# EAGLE design solderstation_v1_6 (EAGLE 6.5.0)
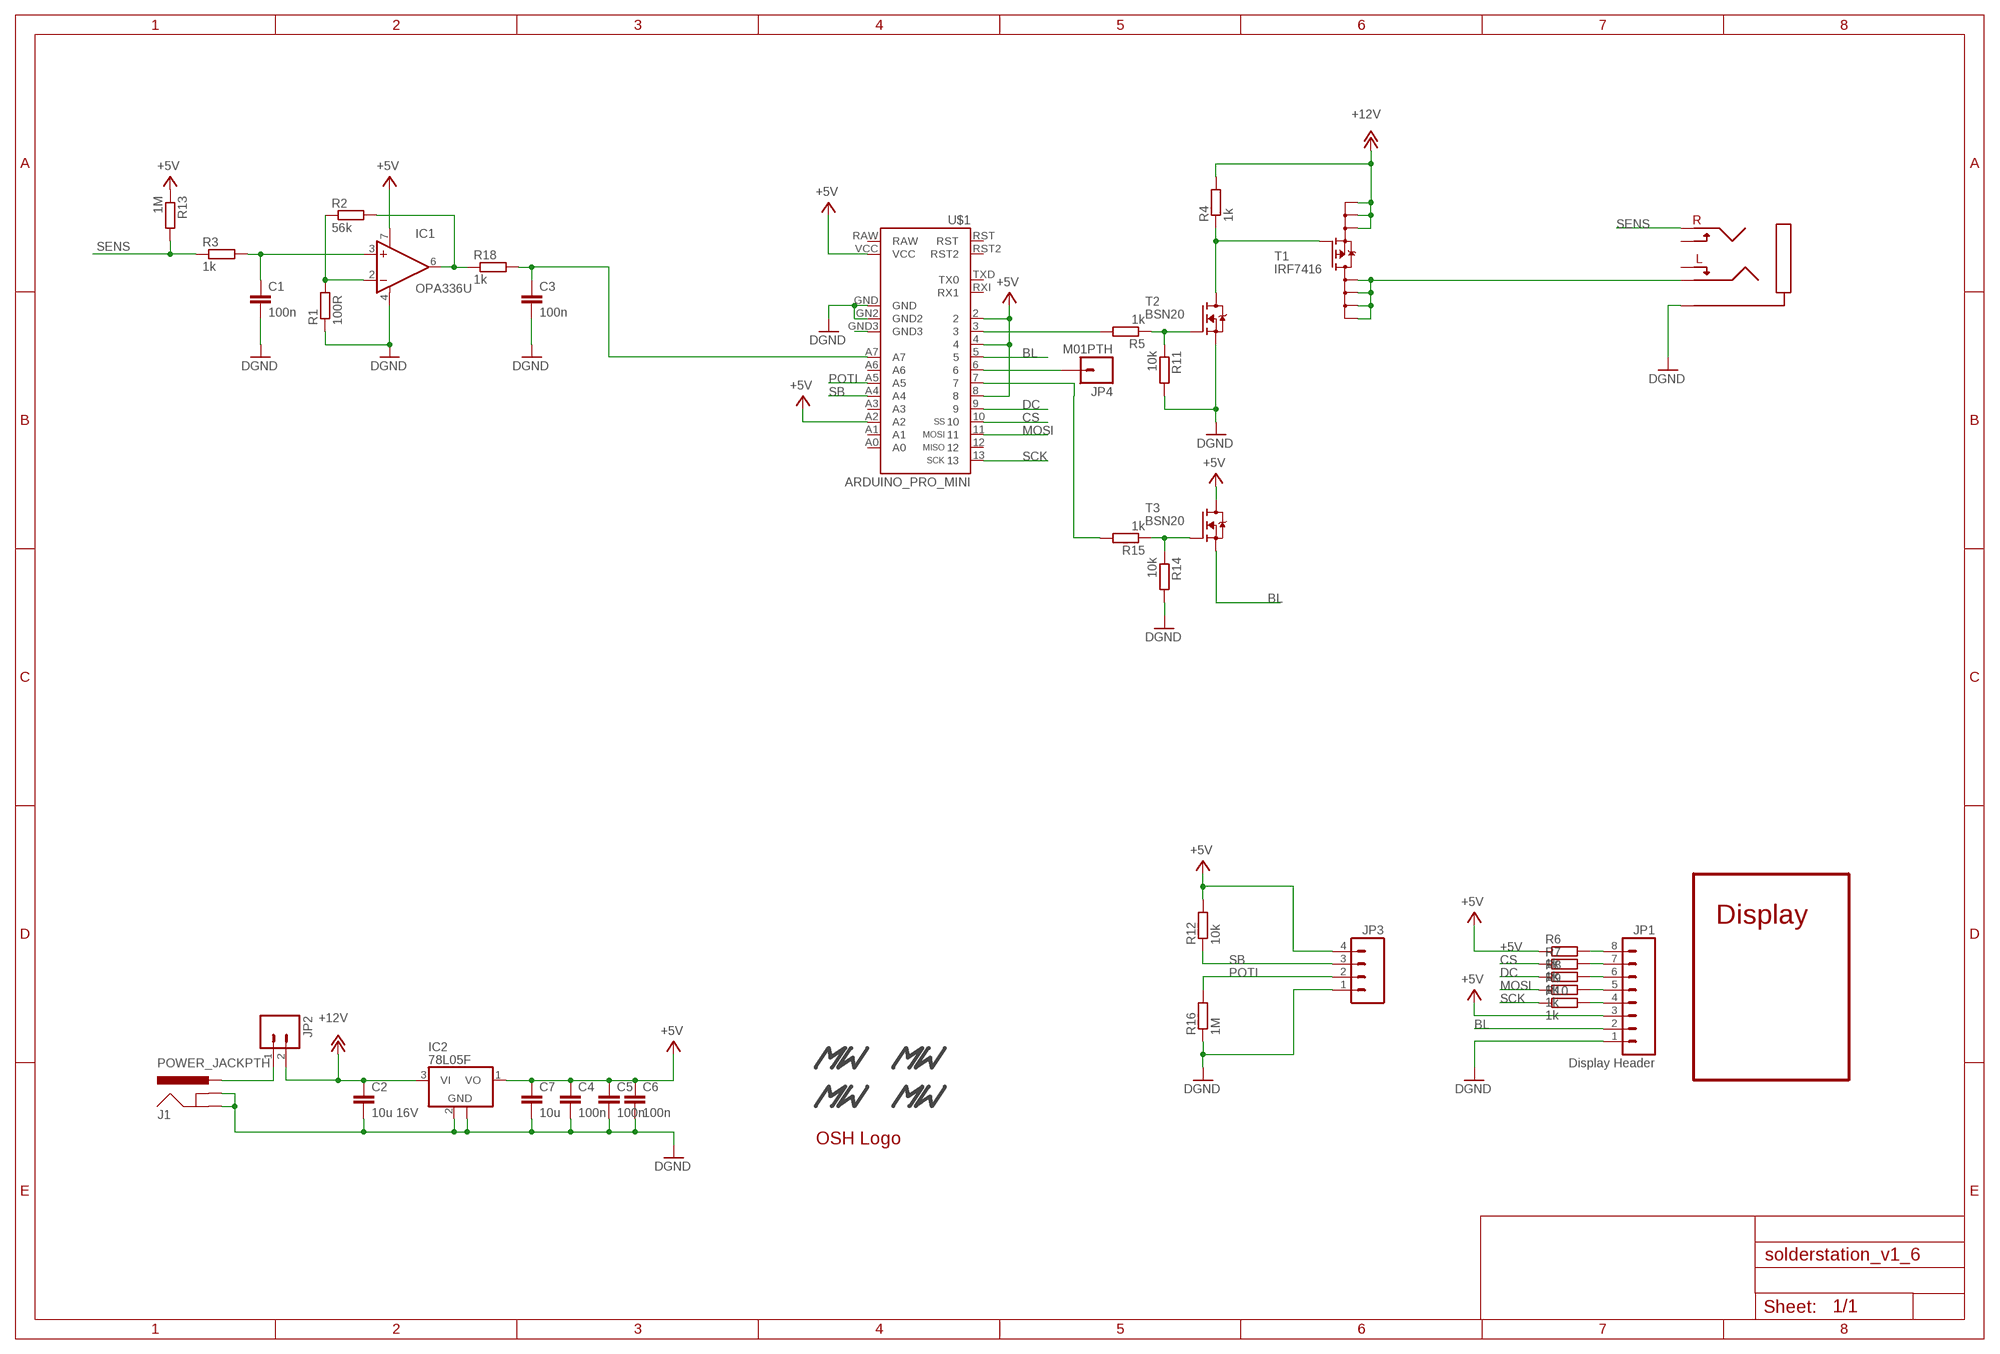
[diagram p0: schematic, sheet 1]

## Parts
C1  100n  C-EUC0603  [C0603]
C2  10u 16V  C-EUC1206  [C1206]
C3  100n  C-EUC0603  [C0603]
C4  100n  C-EUC0603  [C0603]
C5  100n  C-EUC0603  [C0603]
C6  100n  C-EUC0603  [C0603]
C7  10u  C-EUC1206  [C1206]
IC1  OPA336U  [SO08]
IC2  78L05F  [SOT89]
J1  POWER_JACKPTH  [POWER_JACK_PTH]
JP1  Display Header  M08LOCK  [1X08_LOCK]
JP2  M02LOCK_LONGPADS  [1X02_LOCK_LONGPADS]
JP3  M04LOCK  [1X04_LOCK]
JP4  M01PTH  [1X01]
R1  100R  R-EU_R0603  [R0603]
R2  56k  R-EU_R0603  [R0603]
R3  1k  R-EU_R0603  [R0603]
R4  1k  R-EU_R0603  [R0603]
R5  1k  R-EU_R0603  [R0603]
R6  1k  R-EU_R0603  [R0603]
R7  1k  R-EU_R0603  [R0603]
R8  1k  R-EU_R0603  [R0603]
R9  1k  R-EU_R0603  [R0603]
R10  1k  R-EU_R0603  [R0603]
R11  10k  R-EU_R0603  [R0603]
R12  10k  R-EU_R0603  [R0603]
R13  1M  R-EU_R0603  [R0603]
R14  10k  R-EU_R0603  [R0603]
R15  1k  R-EU_R0603  [R0603]
R16  1M  R-EU_R0603  [R0603]
R18  1k  R-EU_R0603  [R0603]
T1  IRF7416  [SO8]
T2  BSN20  [SOT23]
T3  BSN20  [SOT23]
U$1  ARDUINO_PRO_MINI  [ARDUINO_PRO_MINI]
U$2  AUDIO_JACK_3,5MMCONRAD  [AUDIO_JACK_3,5MM_CONRAD]
U$3  MW_LOGO  [MW_11X5MM]
U$4  MW_LOGO_SOLDER  [MW_11X5MM_SOLDER]
U$5  MW_LOGO  [MW_11X5MM]
U$8  OSH_LOGOS  [OSH_LOGO_S]
U$9  MW_LOGO_SOLDER  [MW_11X5MM_SOLDER]

## Nets
+5V: C4.1 C5.1 C6.1 C7.1 IC1.7(V+) IC2.1(VO) JP1.3 JP3.4 R6.1 R12.2 R13.1 T3.3(D) U$1.2 U$1.4 U$1.8 U$1.A2 U$1.VCC
+12V: C2.1 IC2.3(VI) JP2.2 R4.2 T1.1(S0) T1.2(S1) T1.3(S2)
BL: JP1.2 T3.2(S) U$1.5
CS: R7.1 U$1.10
DC: R8.1 U$1.9
DGND: C1.2 C2.2 C3.2 C4.2 C5.2 C6.2 C7.2 IC1.4(V-) IC2.2(GND) IC2.2@1(GND) J1.GND J1.GNDBREAK JP1.1 JP3.1 R1.1 R11.2 R14.2 R16.1 T2.2(S) U$1.GN2(GND2) U$1.GND U$2.P_GND
HEATER: T1.5(D0) T1.6(D1) T1.7(D2) T1.8(D3) U$2.P_LEFT
MOSI: R9.1 U$1.11
N$1: IC1.2(-IN) R1.2 R2.1
N$2: IC1.6(OUT) R2.2 R18.1
N$3: R5.1 R11.1 T2.1(G)
N$4: C1.1 IC1.3(+IN) R3.2
N$5: R4.1 T1.4(G) T2.3(D)
N$6: JP1.4 R10.2
N$7: R5.2 U$1.3
N$8: JP1.5 R9.2
N$9: JP1.6 R8.2
N$10: JP1.7 R7.2
N$11: JP1.8 R6.2
N$12: U$1.GND3
N$13: J1.PWR JP2.1
N$14: R14.1 R15.1 T3.1(G)
N$15: R15.2 U$1.7
N$16: JP4.1 U$1.6
N$31: C3.1 R18.2 U$1.A7
POTI: JP3.2 R16.2 U$1.A5
SB: JP3.3 R12.1 U$1.A4
SCK: R10.1 U$1.13
SENS: R3.1 R13.2 U$2.P_RIGHT
Unconnected: U$1.12 U$1.A0 U$1.A1 U$1.A3 U$1.A6 U$1.RAW U$1.RST U$1.RST2 U$1.RXI(RX1) U$1.TXD(TX0) U$2.P_G_L U$2.P_G_R

## Notes on the sheet
- Display

## Library data of the parts
C1-C7 = rcl:C-EU: CAPACITOR, European symbol
IC1 = burr-brown:OPA336: CMOS Operational Amplifiers Single-Supply, MicroPower, MicroAmplifier(TM) Series; MF: TEXAS INSTRUMENT CONNECTORS; MPN: OPA336UA; OC_FARNELL: 1459587; OC_NEWARK: 35C1888
IC2 = linear:78L*: POSITOIV-VOLTAGE REGULATORS Output up to 100 mA Source: http://focus.ti.com/lit/ds/symlink/ua78l05.pdf
J1 = SparkFun:POWER_JACK: Power Jack This is the standard 5.5mm barrel jack for power. The PTH is the most common, proven, reliable, footprint. All others are experimental. The Slot footprint only works if the mill layer is transmitted to the PCB fab house so be warned. Spark Fun Electronics SKU : PRT-00119. Mating wall wart : TOL-00298 (and others)
JP1 = SparkFun:M08: Header 8 Standard 8-pin 0.1" header. Use with straight break away headers (SKU : PRT-00116), right angle break away headers (PRT-00553), swiss pins (PRT-00743), machine pins (PRT-00117), and female headers (PRT-00115).
JP2 = SparkFun:M02: Header 2 Standard 2-pin 0.1" header. Use with straight break away headers (SKU : PRT-00116), right angle break away headers (PRT-00553), swiss pins (PRT-00743), machine pins (PRT-00117), and female headers (PRT-00115). Molex polarized connector foot print use with SKU : PRT-08233 with associated crimp pins and housings.
JP3 = SparkFun:M04: Header 4 Standard 4-pin 0.1" header. Use with straight break away headers (SKU : PRT-00116), right angle break away headers (PRT-00553), swiss pins (PRT-00743), machine pins (PRT-00117), and female headers (PRT-00115). Molex polarized connector foot print use with SKU : PRT-08231 with associated crimp pins and housings. 1MM SMD Version SKU: PRT-10208
JP4 = SparkFun:M01: Header 1 Standard 1-pin 0.1" header. Use with straight break away headers (SKU : PRT-00116), right angle break away headers (PRT-00553), swiss pins (PRT-00743), machine pins (PRT-00117), and female headers (PRT-00115).
R1-R16 R18 = rcl:R-EU_: RESISTOR, European symbol
T1 = IRF74xx:IRF7416
T2 T3 = bsn20:BSN20
U$1 = SparkFun:ARDUINO_PRO_MINI
U$2 = Matthias:AUDIO_JACK_3,5MM
U$3 U$5 = MWlogo:MW_LOGO
U$4 U$9 = MWlogo:MW_LOGO_SOLDER
U$8 = Logos:OSH_LOGO

## Board
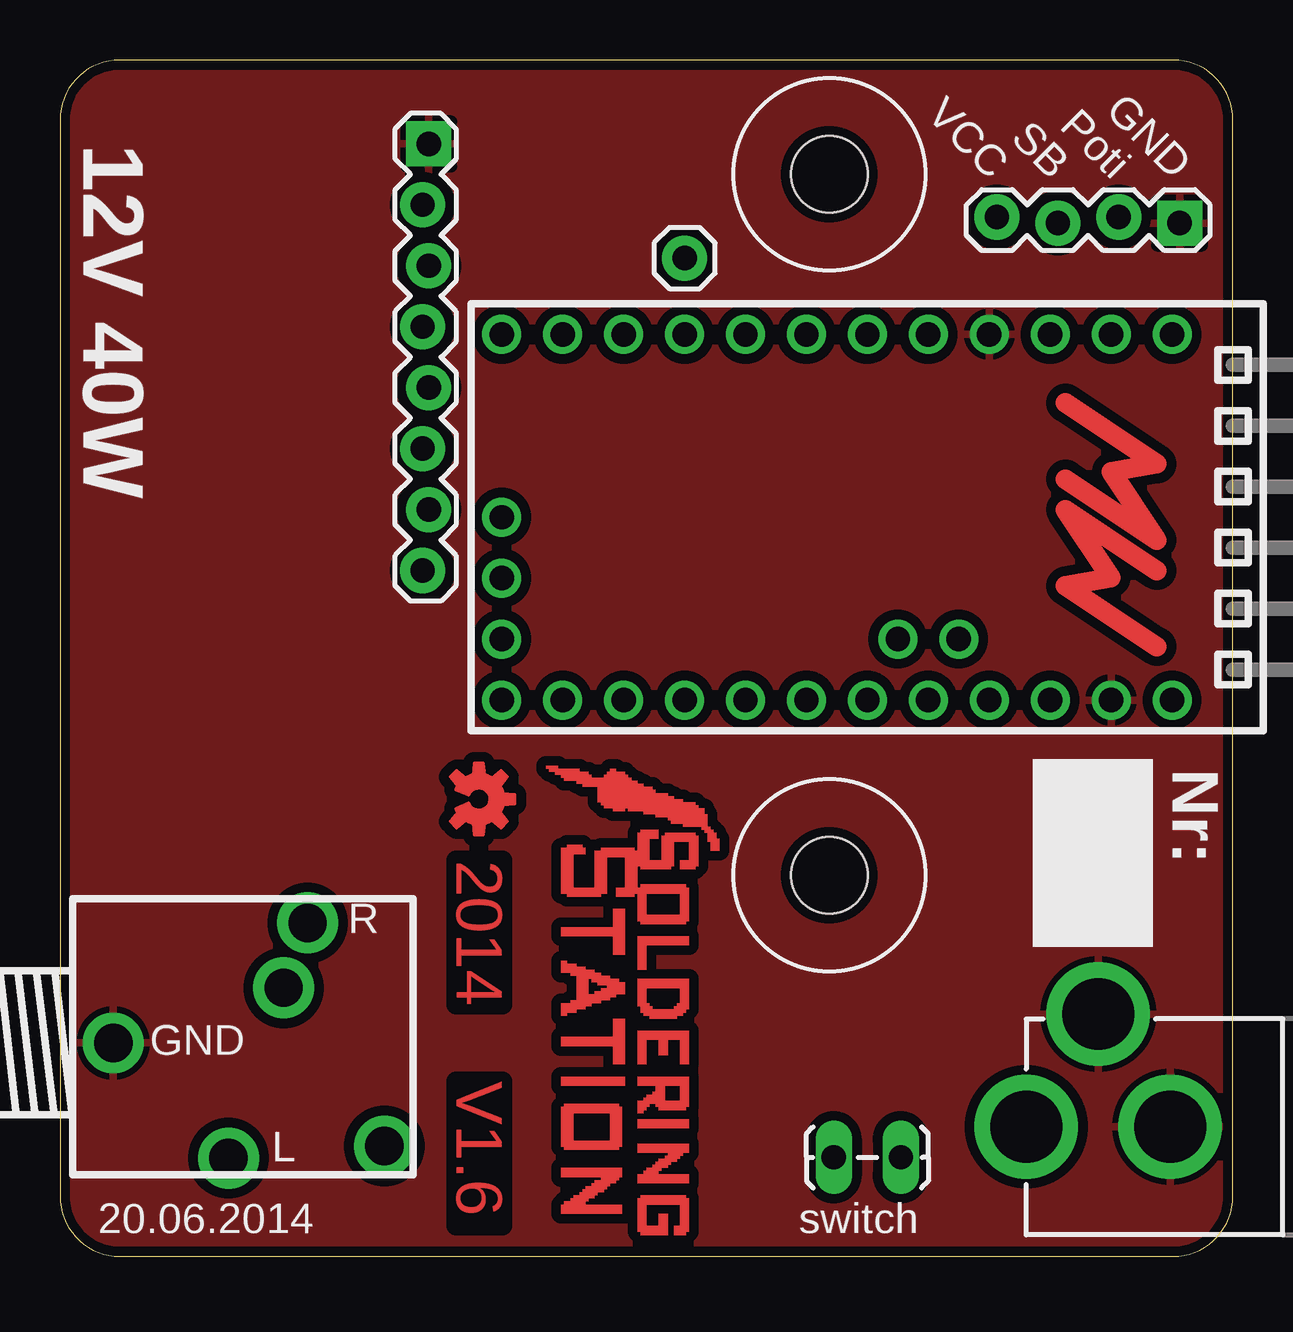
[diagram p1: board, top side]
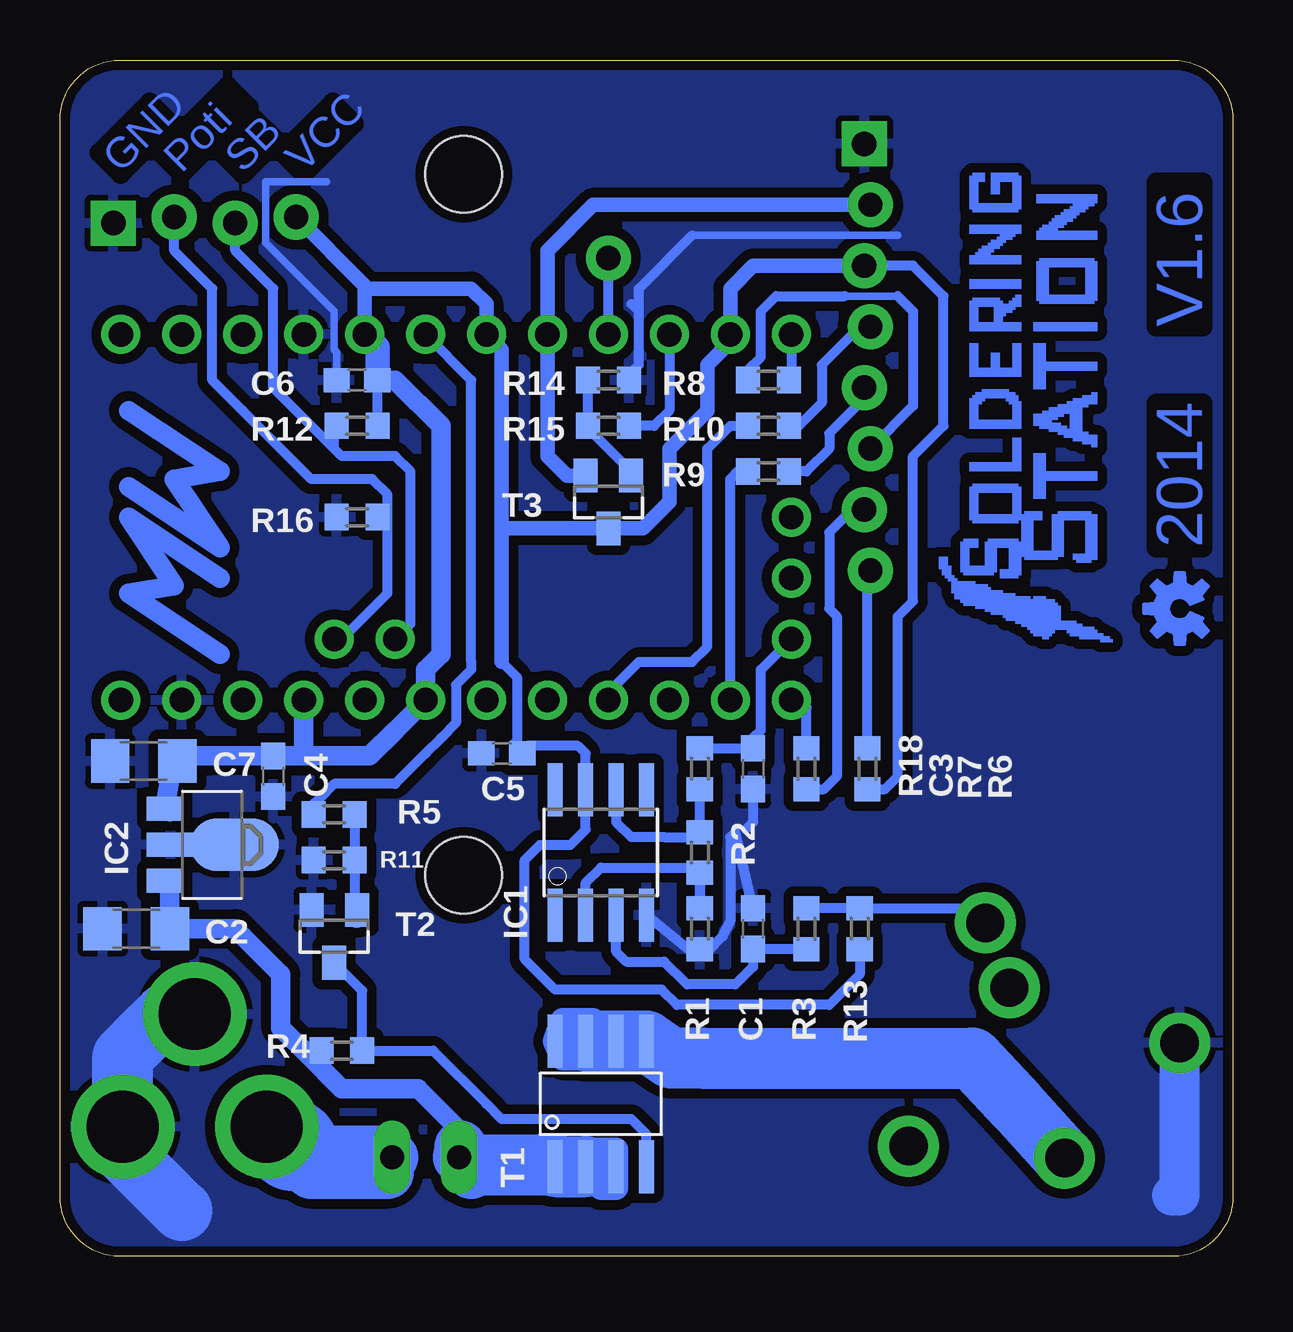
[diagram p2: board, bottom side, seen from below]

Size 48.9 x 49.85 mm. Coordinates in mm from the lower left corner, seen from the top.
Outline: 0,47.35 0,2.5 arc90 2.5,0 46.4,0 arc90 48.9,2.5 48.9,47.35 arc90 46.4,49.85 2.5,49.85 arc90 0,47.35
Copper layers (1*16): Top 0.035mm / dielectric 1.5mm / Bottom 0.035mm
Design rules "dirt_cheap_dirty_boards.v1": minimum track width 5mil, minimum drill 12mil, track to track 5mil, track to pad 5mil, pad to pad 5mil, via to via 5mil, smd to smd 0mil, copper to edge 10mil, drill to drill 10mil, minimum pad ring 10mil, minimum via ring 6mil, stop-mask expansion 2mil, vias tented up to drill 25mil, thermal gap 10mil
Holes 3.2 mm at 32.07,15.88 32.07,45.09

### Footprints (pad centres in the part's own frame; a part is rotated, then mirrored left to right if it is on the bottom)
C0603 = smd 1.1 x 1: 1 -0.85,0; 2 0.85,0
C1206 = smd 1.6 x 1.8: 1 -1.4,0; 2 1.4,0
SO08 = smd 0.61 x 2.21: 1 -1.905,-2.616; 2 -0.635,-2.616; 3 0.635,-2.616; 4 1.905,-2.616; 5 1.905,2.616; 6 0.635,2.616; 7 -0.635,2.616; 8 -1.905,2.616
SOT89 = smd 1 x 1.5: 1 -1.499,-1.981; 3 1.499,-1.981 | smd 1 x 2: 2 0,-1.727 | smd 2.2 x 3.7: 2@1 0,0.94
POWER_JACK_PTH = drill 2.997 pad 4.318: GND 0,7.7; GNDBREAK 4.7,10.7; PWR 0,13.7
1X08_LOCK = drill 1.016 pad 1.88 square: 1 0,0.127 | drill 1.016 pad 1.88: 2 2.54,-0.127; 3 5.08,0.127; 4 7.62,-0.127; 5 10.16,0.127; 6 12.7,-0.127; 7 15.24,0.127; 8 17.78,-0.127
1X02_LOCK_LONGPADS = drill 1.016 long: 1 -0.127,0; 2 2.667,0
1X04_LOCK = drill 1.016 pad 1.88 square: 1 0,0.127 | drill 1.016 pad 1.88: 2 2.54,-0.127; 3 5.08,0.127; 4 7.62,-0.127
1X01 = drill 1.016 pad 1.88: 1 0,0
R0603 = smd 1 x 1.1: 1 -0.85,0; 2 0.85,0
SO8 = smd 2.21 x 0.61: 1 2.616,-1.905; 2 2.616,-0.635; 3 2.616,0.635; 4 2.616,1.905; 5 -2.616,1.905; 6 -2.616,0.635; 7 -2.616,-0.635; 8 -2.616,-1.905
SOT23 = smd 1 x 1.4: 1 -0.95,-1.1; 2 0.95,-1.1; 3 0,1.1
ARDUINO_PRO_MINI = drill 1.016 pad 1.626: 2 1.27,19.05; 3 1.27,16.51; 4 1.27,13.97; 5 1.27,11.43; 6 1.27,8.89; 7 1.27,6.35; 8 1.27,3.81; 9 1.27,1.27; 10 16.51,1.27; 11 16.51,3.81; 12 16.51,6.35; 13 16.51,8.89; A0 16.51,11.43; A1 16.51,13.97; A2 16.51,16.51; A3 16.51,19.05; A4 13.97,17.78; A5 13.97,20.32; A6 11.43,1.27; A7 13.97,1.27; GN2 16.51,26.67; GND 1.27,21.59; GND3 8.89,1.27; RAW 16.51,29.21; RST 1.27,24.13; RST2 16.51,24.13; RXI 1.27,26.67; TXD 1.27,29.21; VCC 16.51,21.59
AUDIO_JACK_3,5MM_CONRAD = drill 1.6 pad 2.54: P_G_L 11.3,-4.3; P_G_R 7.1,2.3; P_GND 0,0; P_LEFT 4.8,-4.8; P_RIGHT 8.1,5

### Placement (x,y rotation side)
C1  20,13.65 90 bottom
C2  45.72,13.65 180 bottom
C3  20,20.32 270 bottom
C4  40.01,20 270 bottom
C5  30.48,20.95 180 bottom
C6  36.51,36.51 180 bottom
C7  45.4,20.64 180 bottom
IC1  26.35,16.83 0 bottom
IC2  42.55,17.14 270 bottom
J1  53.98,5.4 90 top
JP1  15.24,46.35 270 top
JP2  34.92,4.13 180 top
JP3  46.67,43.18 180 top
JP4  26.04,41.59 0 top
R1  22.23,13.65 90 bottom
R2  22.23,16.83 90 bottom
R3  17.78,13.65 270 bottom
R4  37.15,8.57 180 bottom
R5  37.47,18.41 180 bottom
R6  15.24,20.32 90 bottom
R7  17.78,20.32 270 bottom
R8  19.37,36.51 180 bottom
R9  19.37,32.7 0 bottom
R10  19.37,34.61 0 bottom
R11  37.47,16.51 180 bottom
R12  36.51,34.61 0 bottom
R13  15.56,13.65 90 bottom
R14  26.04,36.51 0 bottom
R15  26.04,34.61 0 bottom
R16  36.51,30.8 0 bottom
R18  22.23,20.32 90 bottom
T1  26.35,6.35 270 bottom
T2  37.47,13.34 180 bottom
T3  26.04,31.43 180 bottom
U$1  17.14,39.69 270 top
U$2  2.22,8.89 0 top
U$3  42.23,25.08 90 bottom
U$4  42.23,25.08 90 bottom
U$5  45.72,25.4 90 top
U$6  SOLDER_STATION19,5MM_BOT  [SOLDER_STATION_19,5MM_BOT]  20.32,0.95 90 bottom
U$7  SOLDER_STATION19,5MM_BOT  [SOLDER_STATION_19,5MM_BOT]  5.08,45.09 270 top
U$8  2.22,26.99 270 top
U$9  45.72,25.4 90 top
U$10  OSH_LOGOS  [OSH_LOGO_S]  17.46,19.05 90 bottom

### Tracks (layer width: path | path; a pad name or v marks a point on that pad's centre or on a via)
+5V
  Bottom 0.406: 30.48,24.77 29.84,24.13 29.84,21.48 29.95,21.38 29.53,20.95 C5.1 29.43,21.27 27.3,21.27 26.99,20.95 IC1.7 26.99,17.78 27.62,17.14 28.89,17.14 29.53,16.51 29.53,12.38 28.26,11.11 23.81,11.11 23.18,10.48 16.83,10.48 15.56,11.75 R13.1 | R6.1 14.5,19.47 13.97,20 13.97,26.67 13.34,27.3 13.34,33.34 12.06,34.61 12.06,40.01 13.34,41.27 JP1.3 | R12.2 C6.1
  Bottom 0.61: U$1.2 36.2,40.32 | 36.2,40.32 36.2,40.45 JP3.4 | 36.2,40.32 31.75,40.32 31.11,39.69 U$1.4 30.48,37.78 30.48,30.16 | 30.48,24.77 30.48,30.16 | 30.48,30.16 30.33,30.33 T3.3 24.59,30.33 24.45,30.48 23.5,31.43 23.5,33.66 21.91,35.24 21.91,37.15 20.95,38.1 U$1.8 20.95,40.32 20,41.27 JP1.3
  Bottom 0.813: C4.1 42.65,20.85 43.79,20.85 C7.1 44.21,20.43 IC2.1 44.32,18.53 | C4.1 35.98,20.85 34.92,21.91 U$1.A2 33.66,24.45 33.02,25.08 33.02,25.4 33.02,34.61 34.92,36.51 C6.1 | U$1.VCC 38.73,20.95 38.84,20.85 C4.1
  Bottom 1.016: C6.1 35.66,37.88 U$1.2
+12V
  Bottom 0.813: IC2.3 44.32,15.53 C2.1 41.59,13.65 41.27,13.34 39.69,11.75 39.69,9.53 38.58,8.41 | JP2.2 32.19,5.21 33.97,6.99 37.15,6.99 38.58,8.41 | R4.2 38.42,8.57 38.58,8.41
  Bottom 1.016: T1.2 26.67,4.45 25.72,4.45 T1.3 | T1.3 25.72,2.86 25.96,2.86 | 25.96,2.86 26.35,2.86 25.96,2.86 | 25.96,2.86 T1.3
  Bottom 2.184: JP2.2 32.19,4.57 31.75,3.49 31.43,3.81 31.75,3.81 | 28.18,3.81 T1.1
  Bottom 2.54: 31.75,3.81 28.18,3.81 | T1.1 T1.2
BL
  Bottom 0.61: T3.2 27.77,32.53 28.57,33.34 U$1.5 28.57,41.91 26.67,43.81 JP1.2
CS
  Bottom 0.406: U$1.10 18.1,23.18 17.78,22.86 R7.1
DC
  Bottom 0.406: U$1.9 18.41,36.62 R8.1
DGND
  Bottom 0.305: 22.54,42.55 13.97,42.55 | C6.2 37.36,37.68 37.47,37.78 37.47,39.37 40.32,42.23 40.32,44.45 40.32,44.77 37.78,44.77
  Bottom 0.406: C1.2 20.74,17.68 20.95,17.46 20.95,13.97 21.27,13.34 21.8,12.8 R1.1 22.72,12.8 IC1.4 | C3.2 20,18.1 20.32,17.78 | R14.2 25.18,36.73 24.77,37.15 24.77,39.37 | 24.77,39.37 25.08,39.69 | 24.77,39.37 24.77,40.32 22.54,42.55
  Bottom 1.016: 46.99,20.64 C7.2
  Bottom 1.676: 2.54,2.54 2.22,2.54 2.22,2.86 U$2.P_GND
  Bottom 2.54: 43.81,1.91 46.27,4.37 J1.GND 46.27,8.34 45.72,8.89 44.51,10.1 J1.GNDBREAK
  pour Bottom (isolate 0.406): 0,47.03 0,2.5 arc90 2.5,0 46.08,0 arc90 48.58,2.5 48.58,47.03 arc90 46.08,49.53 2.5,49.53 arc90
  pour Top (isolate 0.406): 0,47.35 0,2.5 arc90 2.5,0 46.4,0 arc90 48.9,2.5 48.9,47.35 arc90 46.4,49.85 2.5,49.85 arc90
HEATER
  Bottom 1.016: T1.7 26.67,9.84 27.94,9.84 T1.8 | T1.8 27.94,8.26 27.23,8.26 | 27.23,8.26 26.99,8.26 27.23,8.26 | 27.23,8.26 T1.8
  Bottom 2.54: U$2.P_LEFT 9.01,6.27 10.87,8.26 22.15,8.26 23.42,8.26 T1.5 T1.6 T1.7
MOSI
  Bottom 0.406: U$1.11 20.95,24.13 20.95,32.38 20.64,32.7 R9.1
N$1
  Bottom 0.406: IC1.2 26.99,15.56 26.35,16.19 22.44,16.19 R2.1 | R2.1 22.23,14.92 | R1.2 22.23,14.92 | 22.23,14.92 R2.1
N$2
  Bottom 0.406: IC1.6 25.72,18.1 25.08,17.46 23.71,17.46 22.44,17.46 R2.2 R18.1
N$3
  Bottom 0.406: R5.1 R11.1 36.62,13.9 | 36.62,13.9 T2.1 | 36.62,13.9 36.44,13.9
N$4
  Bottom 0.406: IC1.3 25.72,12.7 25.3,12.28 23.71,12.28 22.76,11.33 20.74,11.33 20,12.06 C1.1 R3.2
N$5
  Bottom 0.406: T1.4 24.45,5.08 25.08,5.71 30.48,5.71 31.11,6.35 33.34,8.57 R4.1 36.3,8.68 36.3,11.07 T2.3
N$6
  Bottom 0.406: R10.2 18.1,34.61 17.14,35.56 17.14,37.15 15.56,38.73 JP1.4
N$7
  Bottom 0.406: U$1.3 31.75,36.51 31.75,24.77 31.75,24.45 32.38,23.81 32.38,22.23 33.02,21.59 33.66,20.95 34.92,19.68 37.47,19.68 38.1,19.05 38.31,18.84 R5.2
N$8
  Bottom 0.406: JP1.5 15.56,35.56 16.83,34.29 16.83,33.66 17.78,32.7 R9.2
N$9
  Bottom 0.305: 16.19,40.01 13.97,40.01
  Bottom 0.406: R8.2 20.22,36.93 19.68,37.47 19.68,39.37 19.05,40.01 16.19,40.01 | 13.97,40.01 13.34,39.37 13.34,35.43 JP1.6
N$10
  Bottom 0.406: JP1.7 15.88,31.11 16.83,30.16 16.83,26.99 16.51,26.67 16.51,20 17.04,19.47 R7.2
N$11
  Bottom 0.406: R6.2 15.24,28.38 JP1.8
N$13
  Bottom 2.004: 35.24,4.13 35.24,4.45 37.78,4.45
  Bottom 2.184: 39.2,4.64 39.51,4.27 38.42,3.49 35.24,3.49 35.24,4.13 35.69,4.13 JP2.1
  Bottom 3.81: 39.2,4.64 J1.PWR
N$14
  Bottom 0.406: T3.1 25.4,32.53 25.4,33.02 26.67,34.29 26.89,34.51 R15.1 R14.1
N$15
  Bottom 0.406: U$1.7 23.5,35.24 24.13,34.61 R15.2
N$16
  Bottom 0.406: U$1.6 JP4.1
N$31
  Bottom 0.406: R18.2 C3.1 20,21.59 19.68,21.91 19.68,24.45 U$1.A7
POTI
  Bottom 0.406: U$1.A5 37.15,25.72 35.24,27.62 35.24,30.48 | 35.24,30.48 35.24,31.75 35.88,32.38 38.42,32.38 41.27,35.24 42.55,36.51 42.55,40.32 44.13,41.91 JP3.2 | R16.2 35.56,30.8 35.24,30.48
SB
  Bottom 0.406: 37.47,33.66 37.47,34.51 R12.1 | 37.47,33.66 40.01,36.2 40.01,40.32 41.59,41.91 JP3.3 | U$1.A4 34.29,26.35 34.29,32.7 34.92,33.34 37.15,33.34 37.47,33.66
SCK
  Bottom 0.406: R10.1 20.95,34.61 21.91,33.66 21.91,25.4 22.54,24.77 24.77,24.77 26.04,23.5 U$1.13
SENS
  Bottom 0.406: R3.1 R13.2 10.94,14.5 U$2.P_RIGHT

### Text on the board
Top: 2014 | V1.6
Bottom: VCC | SB | Poti | GND | V1.6 | 2014
tPlace: VCC | SB | Poti | GND
tNames: 12V 40W | Nr: | 20.06.2014 | switch
tStop: 2014 | V1.6
bStop: VCC | SB | Poti | GND | V1.6 | 2014
bRestrict: .